# Altium schematic sheet FPGA.SchDoc
size Letter
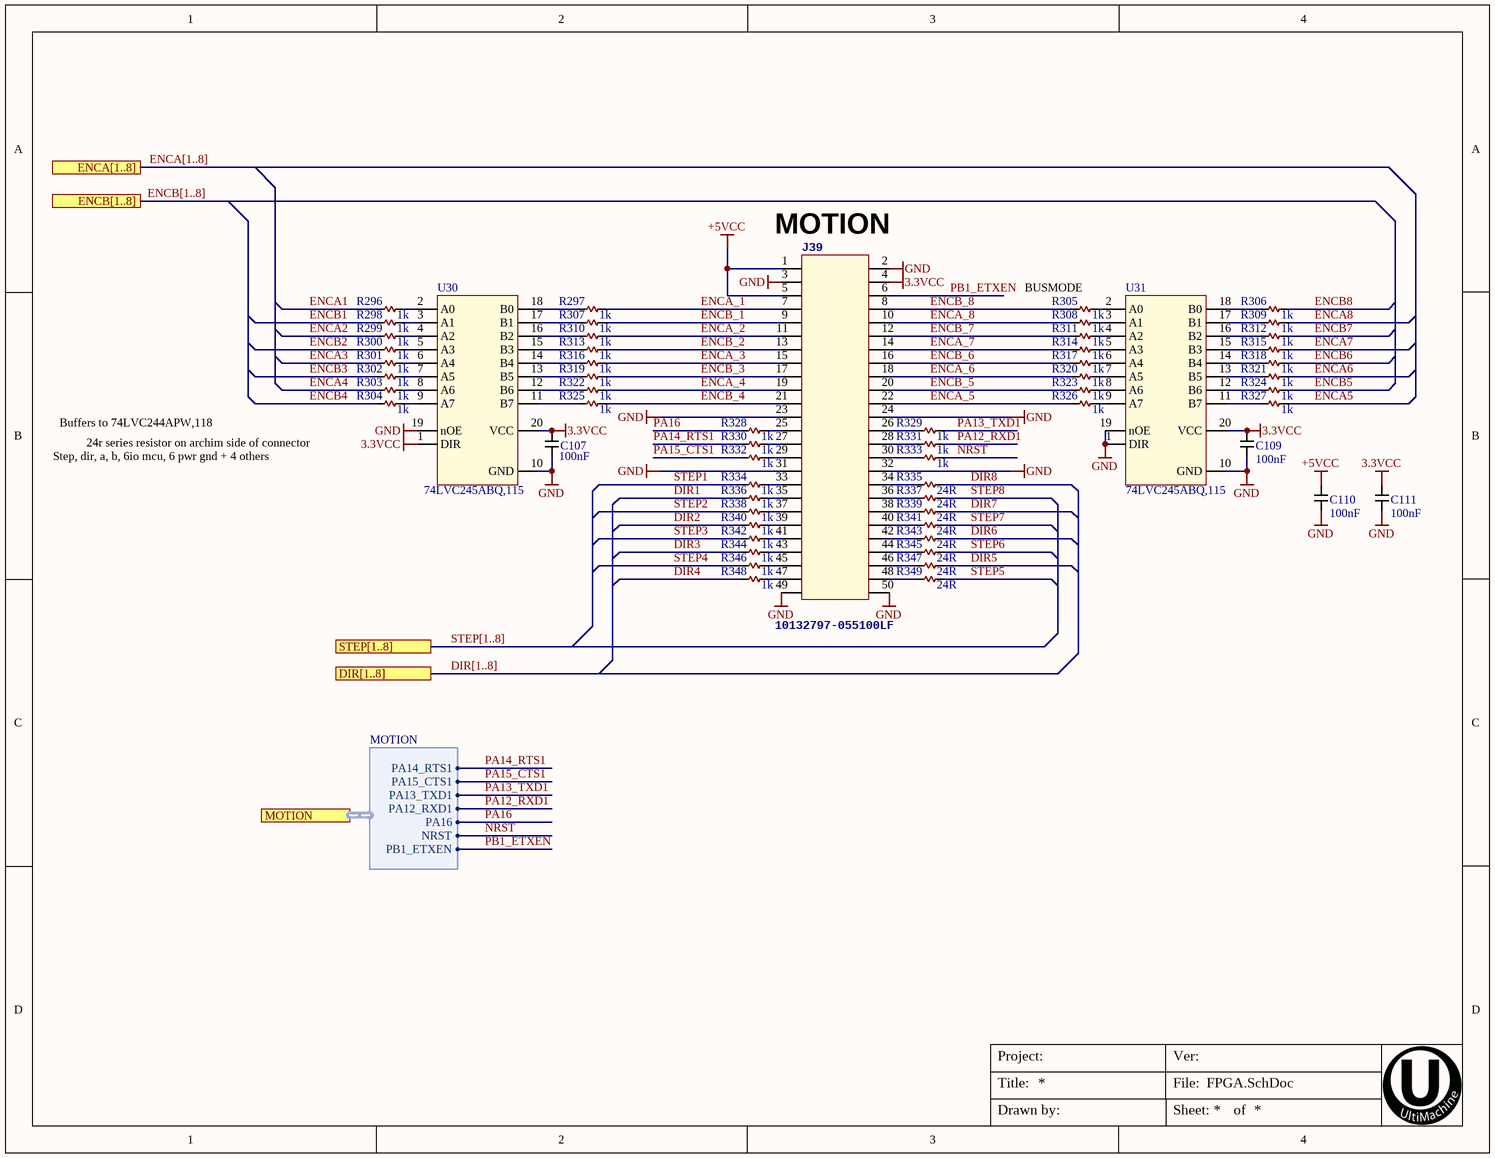
[diagram p0: FPGA.SchDoc]

## Parts
C107  100nF  [C0201 Large Pads]
C109  100nF  [C0201 Large Pads]
C110  100nF  [C0201 Large Pads]
C111  100nF  [C0201 Large Pads]
J39  10132797-055100LF  [BTB 0.5mm 50pin-Female]
R296  1k  [R0402]
R297  1k  [R0402]
R298  1k  [R0402]
R299  1k  [R0402]
R300  1k  [R0402]
R301  1k  [R0402]
R302  1k  [R0402]
R303  1k  [R0402]
R304  1k  [R0402]
R305  1k  [R0402]
R306  1k  [R0402]
R307  1k  [R0402]
R308  1k  [R0402]
R309  1k  [R0402]
R310  1k  [R0402]
R311  1k  [R0402]
R312  1k  [R0402]
R313  1k  [R0402]
R314  1k  [R0402]
R315  1k  [R0402]
R316  1k  [R0402]
R317  1k  [R0402]
R318  1k  [R0402]
R319  1k  [R0402]
R320  1k  [R0402]
R321  1k  [R0402]
R322  1k  [R0402]
R323  1k  [R0402]
R324  1k  [R0402]
R325  1k  [R0402]
R326  1k  [R0402]
R327  1k  [R0402]
R328  1k  [R0402]
R329  1k  [R0402]
R330  1k  [R0402]
R331  1k  [R0402]
R332  1k  [R0402]
R333  1k  [R0402]
R334  1k  [R0402]
R335  24R  [R0402]
R336  1k  [R0402]
R337  24R  [R0402]
R338  1k  [R0402]
R339  24R  [R0402]
R340  1k  [R0402]
R341  24R  [R0402]
R342  1k  [R0402]
R343  24R  [R0402]
R344  1k  [R0402]
R345  24R  [R0402]
R346  1k  [R0402]
R347  24R  [R0402]
R348  1k  [R0402]
R349  24R  [R0402]
U30  74LVC245ABQ,115  [QFN20-DHVQFN20-QFN50P250X450X100_HS-21L]
U31  74LVC245ABQ,115  [QFN20-DHVQFN20-QFN50P250X450X100_HS-21L]

## Ports
DIR[1..8], ENCA[1..8], ENCB[1..8], MOTION (harness MOTION), STEP[1..8]

## Harnesses
MOTION: PA14_RTS1, PA15_CTS1, PA13_TXD1, PA12_RXD1, PA16, NRST, PB1_ETXEN

## Nets
3.3VCC: C107.2 C109.2 C111.2 J39.4 U30.1(DIR) U30.20(VCC) U31.20(VCC)
+5VCC: C110.2 J39.1 J39.5
GND: C107.1 C109.1 C110.1 C111.1 J39.2 J39.3 J39.23 J39.24 J39.31 J39.32 J39.49 J39.50 U30.10(GND) U30.19(nOE) U31.1(DIR) U31.10(GND) U31.19(nOE)
DIR1: R336.1
DIR2: R340.1
DIR3: R344.1
DIR4: R348.1
DIR5: R347.2
DIR6: R343.2
DIR7: R339.2
DIR8: R335.2
ENCA1: R296.1
ENCA2: R299.1
ENCA3: R301.1
ENCA4: R303.1
ENCA5: R327.2
ENCA6: R321.2
ENCA7: R315.2
ENCA8: R309.2
ENCA_1: J39.7 R297.2
ENCA_2: J39.11 R310.2
ENCA_3: J39.15 R316.2
ENCA_4: J39.19 R322.2
ENCA_5: J39.22 R326.1
ENCA_6: J39.18 R320.1
ENCA_7: J39.14 R314.1
ENCA_8: J39.10 R308.1
ENCB1: R298.1
ENCB2: R300.1
ENCB3: R302.1
ENCB4: R304.1
ENCB5: R324.2
ENCB6: R318.2
ENCB7: R312.2
ENCB8: R306.2
ENCB_1: J39.9 R307.2
ENCB_2: J39.13 R313.2
ENCB_3: J39.17 R319.2
ENCB_4: J39.21 R325.2
ENCB_5: J39.20 R323.1
ENCB_6: J39.16 R317.1
ENCB_7: J39.12 R311.1
ENCB_8: J39.8 R305.1
NRST: R333.2 ; port MOTION.NRST
PA12_RXD1: R331.2 ; port MOTION.PA12_RXD1
PA13_TXD1: R329.2 ; port MOTION.PA13_TXD1
PA14_RTS1: R330.1 ; port MOTION.PA14_RTS1
PA15_CTS1: R332.1 ; port MOTION.PA15_CTS1
PA16: R328.1 ; port MOTION.PA16
PB1_ETXEN: J39.6 ; port MOTION.PB1_ETXEN
STEP1: R334.1
STEP2: R338.1
STEP3: R342.1
STEP4: R346.1
STEP5: R349.2
STEP6: R345.2
STEP7: R341.2
STEP8: R337.2
NetJ39_25: J39.25 R328.2
NetJ39_26: J39.26 R329.1
NetJ39_27: J39.27 R330.2
NetJ39_28: J39.28 R331.1
NetJ39_29: J39.29 R332.2
NetJ39_30: J39.30 R333.1
NetJ39_33: J39.33 R334.2
NetJ39_34: J39.34 R335.1
NetJ39_35: J39.35 R336.2
NetJ39_36: J39.36 R337.1
NetJ39_37: J39.37 R338.2
NetJ39_38: J39.38 R339.1
NetJ39_39: J39.39 R340.2
NetJ39_40: J39.40 R341.1
NetJ39_41: J39.41 R342.2
NetJ39_42: J39.42 R343.1
NetJ39_43: J39.43 R344.2
NetJ39_44: J39.44 R345.1
NetJ39_45: J39.45 R346.2
NetJ39_46: J39.46 R347.1
NetJ39_47: J39.47 R348.2
NetJ39_48: J39.48 R349.1
NetR296_2: R296.2 U30.2(A0)
NetR297_1: R297.1 U30.18(B0)
NetR298_2: R298.2 U30.3(A1)
NetR299_2: R299.2 U30.4(A2)
NetR300_2: R300.2 U30.5(A3)
NetR301_2: R301.2 U30.6(A4)
NetR302_2: R302.2 U30.7(A5)
NetR303_2: R303.2 U30.8(A6)
NetR304_2: R304.2 U30.9(A7)
NetR305_2: R305.2 U31.2(A0)
NetR306_1: R306.1 U31.18(B0)
NetR307_1: R307.1 U30.17(B1)
NetR308_2: R308.2 U31.3(A1)
NetR309_1: R309.1 U31.17(B1)
NetR310_1: R310.1 U30.16(B2)
NetR311_2: R311.2 U31.4(A2)
NetR312_1: R312.1 U31.16(B2)
NetR313_1: R313.1 U30.15(B3)
NetR314_2: R314.2 U31.5(A3)
NetR315_1: R315.1 U31.15(B3)
NetR316_1: R316.1 U30.14(B4)
NetR317_2: R317.2 U31.6(A4)
NetR318_1: R318.1 U31.14(B4)
NetR319_1: R319.1 U30.13(B5)
NetR320_2: R320.2 U31.7(A5)
NetR321_1: R321.1 U31.13(B5)
NetR322_1: R322.1 U30.12(B6)
NetR323_2: R323.2 U31.8(A6)
NetR324_1: R324.1 U31.12(B6)
NetR325_1: R325.1 U30.11(B7)
NetR326_2: R326.2 U31.9(A7)
NetR327_1: R327.1 U31.11(B7)

Not connected (* = marked no-connect by the designer): U30 23(NC); U31 23(NC)

## Buses and harness runs
bus DIR[1..8] = port DIR[1..8]
bus ENCA[1..8] = port ENCA[1..8]
bus ENCB[1..8] = port ENCB[1..8]
bus STEP[1..8] = port STEP[1..8]

## Notes on the sheet
- (near J39) MOTION
- BUSMODE
- Buffers to 74LVC244APW,118
- Step, dir, a, b, 6io mcu, 6 pwr gnd + 4 others
- 24r series resistor on archim side of connector
- Title:
- Project:
- File:
- Ver:
- Drawn by:
- Sheet:
- of

## Library data of the parts
C107 C109-C111 = 100nF 6.3V X5R 0201: CAP CER 0.1UF 6.3V 10% X5R 0201; PART: .1uF; MANUFACTURER: Samsung; MANUFACTURER #: CL03A104KQ3NNNC; DISTRIBUTOR: DIGI-KEY; DISTRIBUTOR #: 1276-1013-1-ND; TOLERANCE: 10%; VOLTAGE: 6.3V
J39 = CONN 50 PIN 0.5mm FEMALE: 50 Position Connector Plug, Outer Shroud Contacts Surface Mount Gold; EE_SPEC: 500V 1A 1.27mm; MANUFACTURER #: 10132797-055100LF; PART: 10132797-055100LF; Part Description: 50 Position Connector Plug, Outer Shroud Contacts Surface Mount Gold
R296-R334 R336 R338 R340 R342 R344 R346 R348 = 1k 1% 0402: RES 0402 1k 63mW 1%; MANUFACTURER: Yageo; MANUFACTURER #: RC0402FR-071KL; PART DESCRIPTION: 1k Ohm ±1% 0.063W, 1/16W Chip Resistor 0402 (1005 Metric) Moisture Resistant Thick Film; EE_SPEC: 1/16W; DISTRIBUTOR #: 311-1.00KLRTR-ND; DISTRIBUTOR: Digikey; PART: 1k 1% 0402; TOLERANCE: 1%; VALUE: 1k
R335 R337 R339 R341 R343 R345 R347 R349 = 24R 1% 0402: Res Thick Film 0402 24 Ohm 1% 0.063W; MANUFACTURER: Yageo; MANUFACTURER #: RC0402FR-0724RL; PART DESCRIPTION: 24 Ohm ±1% 0.063W, 1/16W Chip Resistor 0402 (1005 Metric) Moisture Resistant Thick Film; EE_SPEC: 1/16W; DISTRIBUTOR #: YAG3073TR-ND; DISTRIBUTOR: Digikey; PART: 24R 1% 0402; TOLERANCE: 1%; VALUE: 24R
U30 U31 = 74LVC245ABQ,115: IC TXRX NON-INVERT 3.6V 20DHVQFN; MANUFACTURER: Nexperia; PART DESCRIPTION: Transceiver, Non-Inverting 1 Element 8 Bit per Element 3-State Output 20-DHVQFN-EP (2.5x4.5); TOLERANCE: -NA-; EE_SPEC: 1.65-3.6Vcc, 5V tolerant inputs; MANUFACTURER #: 74LVC245ABQ,115; PART: 74LVC245ABQ,115; VALUE: 74LVC245ABQ,115